# EAGLE design rng1 (EAGLE 6.5.0)

## Sheet 1 of 2
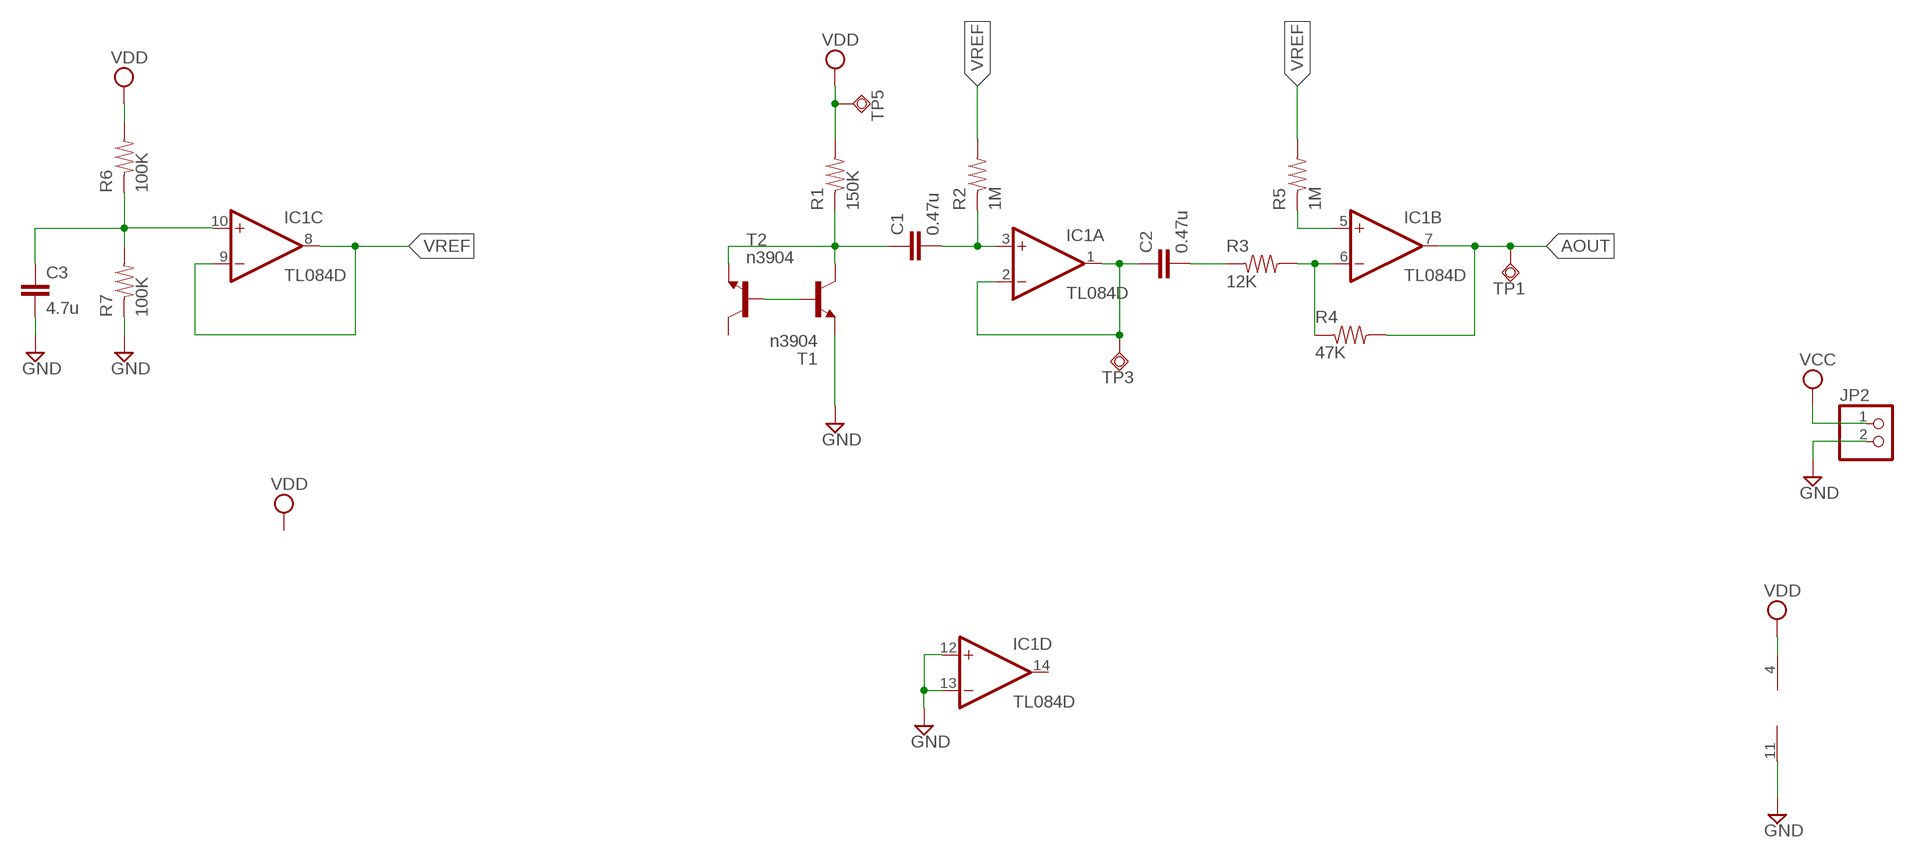
[diagram p0: schematic, sheet 1]

### Parts
C1  0.47u  C-EUC0805  [C0805]
C2  0.47u  C-EUC0805  [C0805]
C3  4.7u  C-EUC0805  [C0805]
IC1  TL084D  [SO14]
JP2  PINHD-1X2  [1X02]
R1  150K  R0805  [R0805]
R2  1M  R0805  [R0805]
R3  12K  R0805  [R0805]
R4  47K  R0805  [R0805]
R5  1M  R0805  [R0805]
R6  100K  R0805  [R0805]
R7  100K  R0805  [R0805]
T1  n3904  MMBT3904LT1-NPN-SOT23-BEC  [SOT23-BEC]
T2  n3904  MMBT3904LT1-NPN-SOT23-BEC  [SOT23-BEC]
TP1  TPSQPAD1-13  [P1-13]
TP3  TPSQPAD1-13  [P1-13]
TP5  TPSQPAD1-13  [P1-13]

### Nets
AOUT: IC1.7(B:OUT) R4.P$2 TP1.TP
GND: C3.2 IC1.11(P:V-) IC1.12(D:+IN) IC1.13(D:-IN) JP2.2 R7.P$1 T2.E ; also sheet 2
N$1: C1.1 R1.P$1 T1.E T2.C
N$2: C3.1 IC1.10(C:+IN) R6.P$1 R7.P$2
N$3: T1.B T2.B
N$4: C1.2 IC1.3(A:+IN) R2.P$1
N$5: C2.1 IC1.1(A:OUT) IC1.2(A:-IN) TP3.TP
N$6: C2.2 R3.P$1
N$7: IC1.6(B:-IN) R3.P$2 R4.P$1
N$8: IC1.5(B:+IN) R5.P$1
VCC: JP2.1 ; also sheet 2
VDD: IC1.4(P:V+) R1.P$2 R6.P$2 TP5.TP ; also sheet 2
VREF: IC1.8(C:OUT) IC1.9(C:-IN) R2.P$2 R5.P$2
Unconnected: IC1.14(D:OUT) T1.C

## Sheet 2 of 2
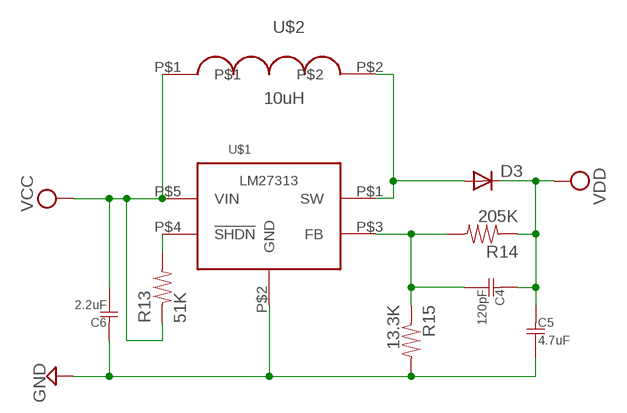
[diagram p1: schematic, sheet 2]

### Parts
C4  120pF  C0805  [R0805]
C5  4.7uF  C0805  [R0805]
C6  2.2uF  C0805  [R0805]
D3  DIODE-SOD123  [SOD123]
R13  51K  R0805  [R0805]
R14  205K  R0805  [R0805]
R15  13.3K  R0805  [R0805]
U$1  LM27313  [SOT-23-5]
U$2  10uH  CB2518  [L1007]

### Nets
GND: C5.P$2 C6.P$1 R15.P$2 U$1.P$2(GND) ; also sheet 1
N$13: R13.P$2 U$1.P$4(!SHDN!)
N$17: D3.A U$1.P$1(SW) U$2.P$2
N$18: C4.P$2 R14.P$2 R15.P$1 U$1.P$3(FB)
VCC: C6.P$2 R13.P$1 U$1.P$5(VIN) U$2.P$1 ; also sheet 1
VDD: C4.P$1 C5.P$1 D3.C R14.P$1 ; also sheet 1

## Library data of the parts
C1-C3 = rcl:C-EU: CAPACITOR, European symbol
C4-C6 = Passives:C
D3 = diode:DIODE-: DIODE
IC1 = linear:TL084: OP AMP
JP2 = pinhead:PINHD-1X2: PIN HEADER
R1-R7 R13-R15 = Passives:R: A standard resistor.
T1 T2 = transistor:*-NPN-: NPN Transistror BF959 corrected 2008.03.06
TP1 TP3 TP5 = testpad:TPSQ: Test pad
U$1 = rng:LM27313
U$2 = rng:CB2518: Inductor

## Board
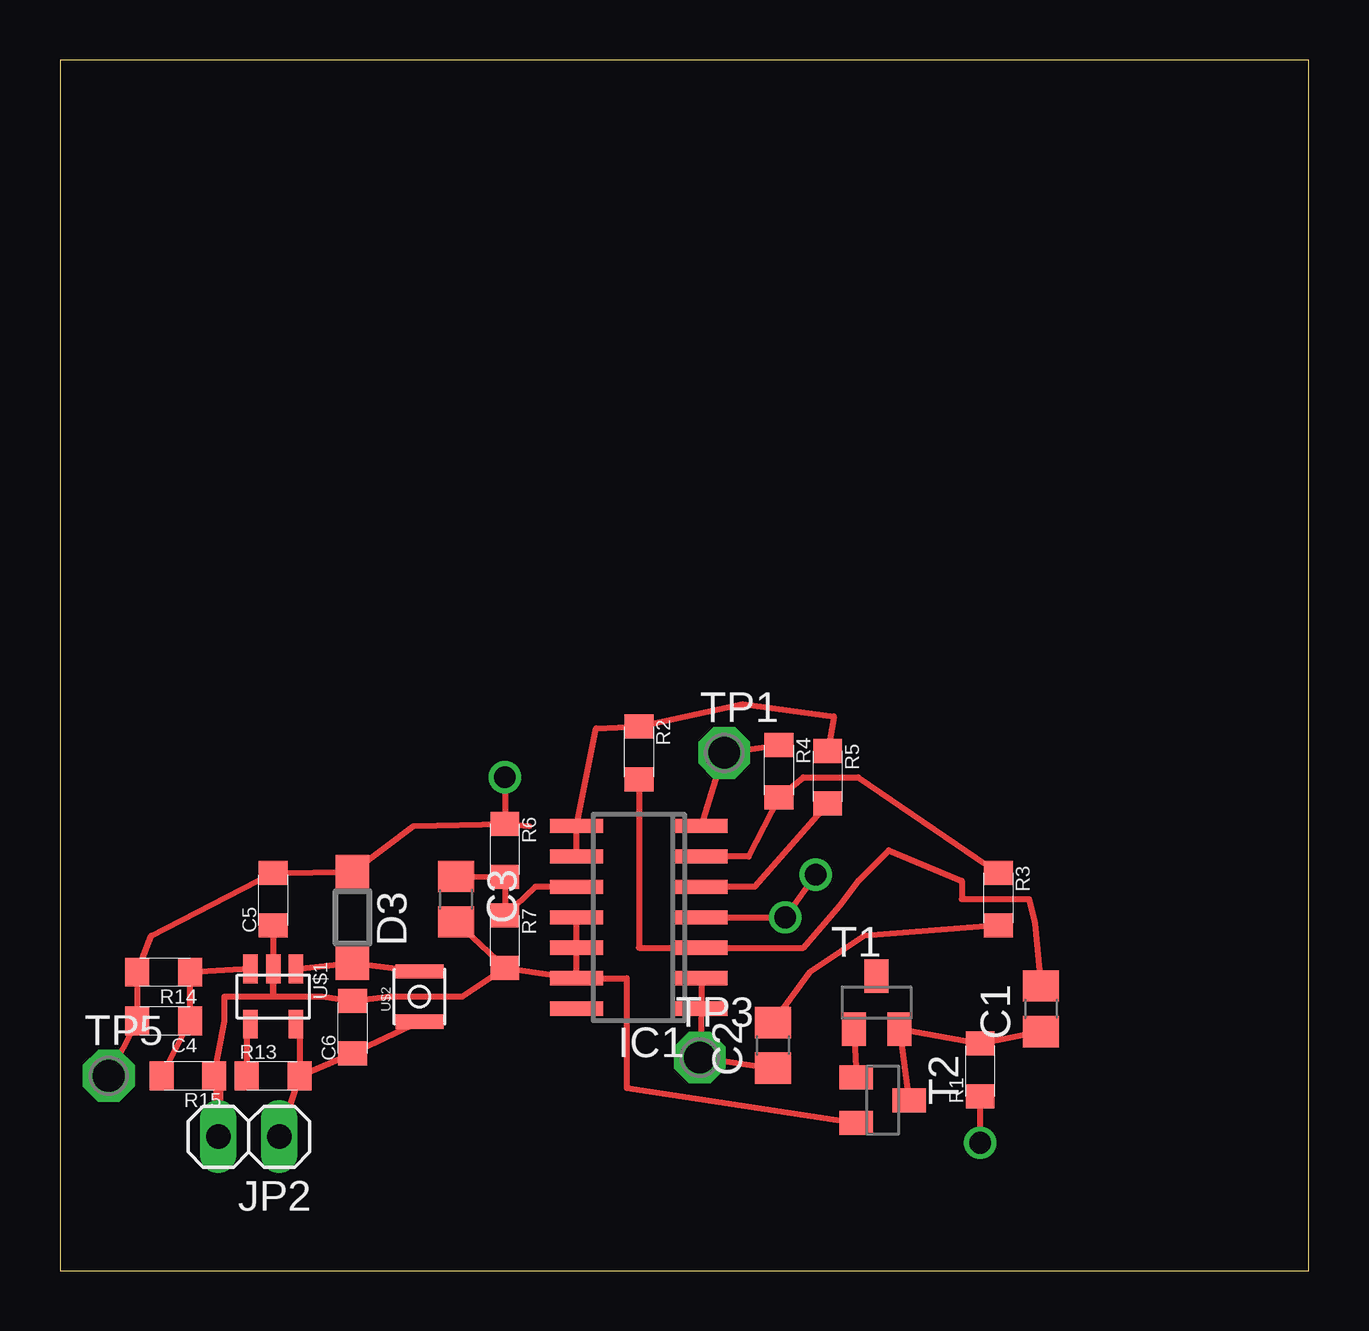
[diagram p2: board, top side]
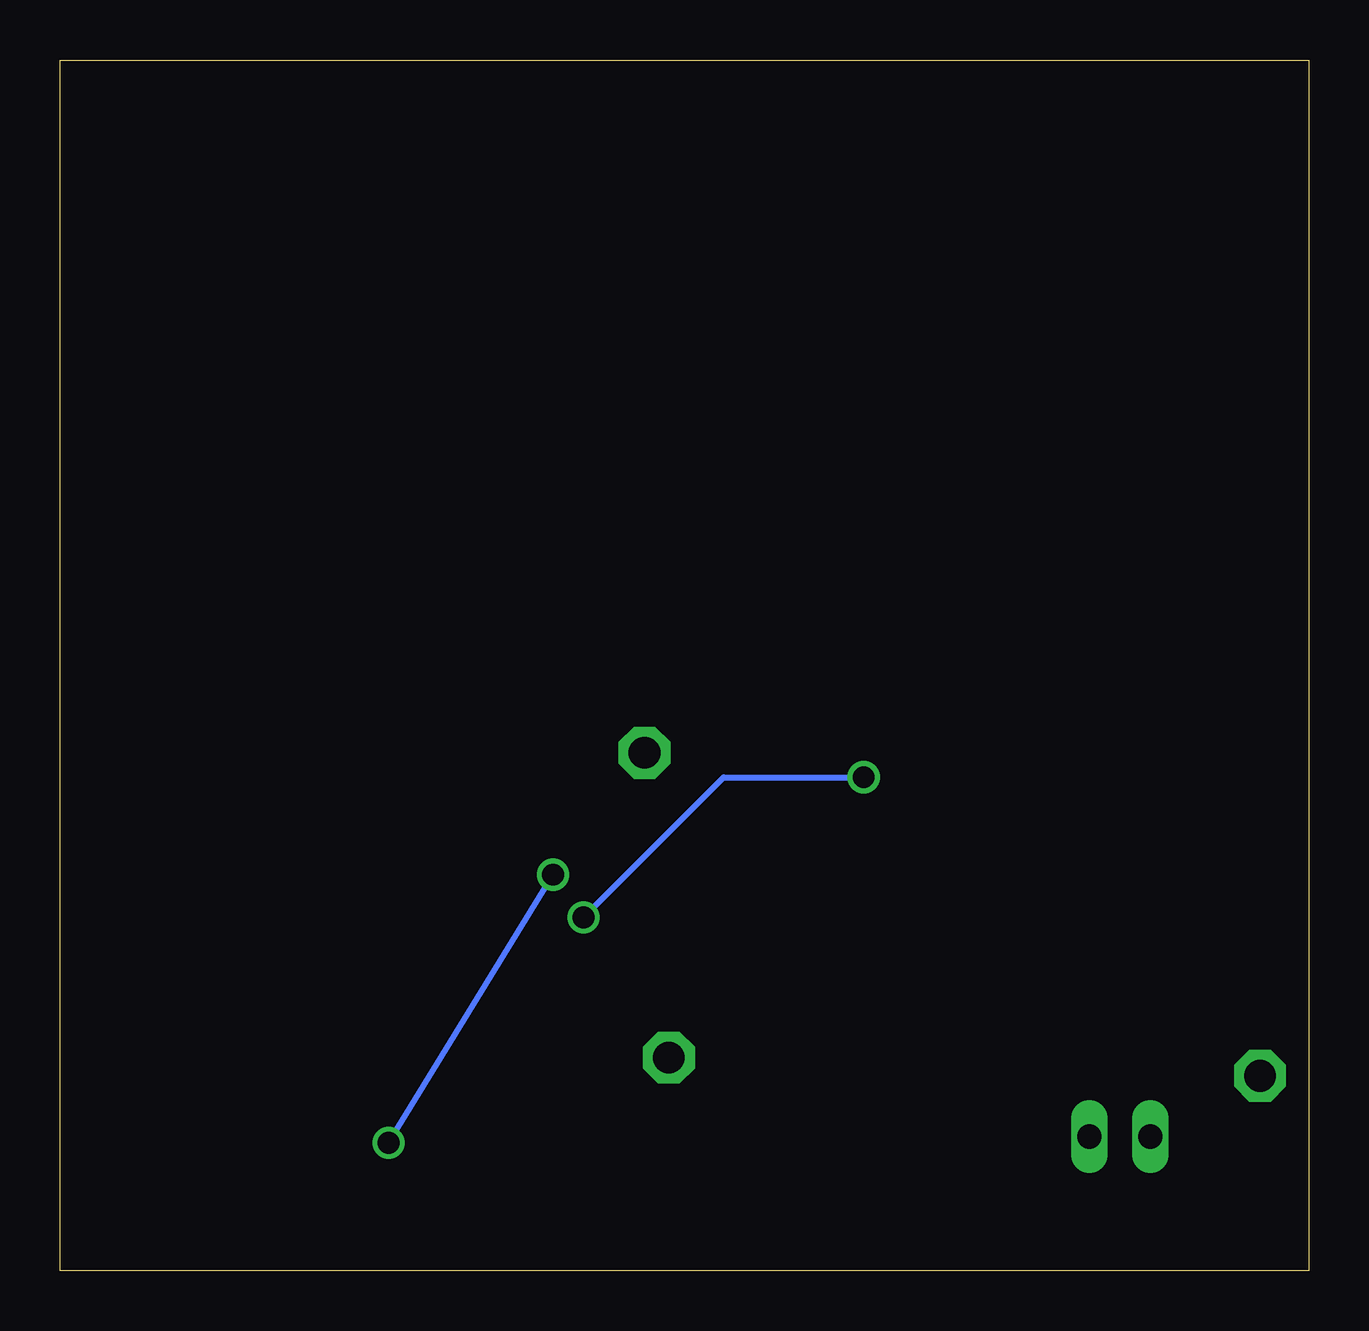
[diagram p3: board, bottom side, seen from below]

Size 52.05 x 50.47 mm. Coordinates in mm from the lower left corner, seen from the top.
Outline: 0,0 52.05,0 52.05,50.47 0,50.47 0,0
Copper layers (1*16): Top 0.035mm / dielectric 1.5mm / Bottom 0.035mm
Design rules "default *": minimum track width 12mil, minimum drill 24mil, track to track 20mil, track to pad 20mil, pad to pad 20mil, via to via 20mil, smd to smd 8mil, copper to edge 40mil, drill to drill 8mil, minimum pad ring 10mil, minimum via ring 8mil, stop-mask expansion 4mil, vias tented up to drill 0mil, thermal gap 10mil

### Footprints (pad centres in the part's own frame; a part is rotated, then mirrored left to right if it is on the bottom)
C0805 = smd 1.3 x 1.5: 1 -0.95,0; 2 0.95,0
R0805 = smd 1 x 1.2: P$1 1.1,0; P$2 -1.1,0
SOD123 = smd 1.4 x 1.4: A 1.9,0; C -1.9,0
SO14 = smd 0.6 x 2.2: 1 -3.81,-2.6; 2 -2.54,-2.6; 3 -1.27,-2.6; 4 0,-2.6; 5 1.27,-2.6; 6 2.54,-2.6; 7 3.81,-2.6; 8 3.81,2.6; 9 2.54,2.6; 10 1.27,2.6; 11 0,2.6; 12 -1.27,2.6; 13 -2.54,2.6; 14 -3.81,2.6
1X02 = drill 1.016 long: 1 -1.27,0; 2 1.27,0
SOT23-BEC = smd 1 x 1.4: B -0.95,-1.1; C 0,1.1; E 0.95,-1.1
P1-13 = drill 1.321 pad 2.159 octagon: TP 0,0
SOT-23-5 = smd 0.6 x 1.2: P$1 -0.95,-1.15; P$2 0,-1.15; P$3 0.95,-1.15; P$4 0.95,1.15; P$5 -0.95,1.15
L1007 = smd 0.6 x 2: P$1 -1.05,0; P$2 1.05,0

### Placement (x,y rotation side)
C1  40.89,10.92 90 top
C2  29.72,9.4 90 top
C3  16.51,15.49 270 top
C4  4.32,10.41 180 top
C5  8.89,15.49 90 top
C6  12.19,10.16 90 top
D3  12.19,14.73 270 top
IC1  24.13,14.73 90 top
JP2  7.87,5.59 180 top
R1  38.35,8.38 90 top
R2  24.13,21.59 270 top
R3  39.12,15.49 270 top
R4  29.97,20.83 270 top
R5  32,20.57 270 top
R6  18.54,17.53 270 top
R7  18.54,13.72 270 top
R13  8.89,8.13 0 top
R14  4.32,12.45 180 top
R15  5.33,8.13 180 top
T1  34.04,11.18 0 top
T2  34.29,7.11 270 top
TP1  27.69,21.59 0 top
TP3  26.67,8.89 0 top
TP5  2.03,8.13 0 top
U$1  8.89,11.43 180 top
U$2  14.99,11.43 90 top

### Tracks (layer width: path | path; a pad name or v marks a point on that pad's centre or on a via)
AOUT
  Top 0.254: R4.P$2 TP1.TP IC1.7
GND
  Top 0.254: C5.P$2 U$1.P$2 | R15.P$2 6.86,10.41 6.86,11.43 8.89,11.43 | 8.89,11.43 U$1.P$2 | U$1.P$2 8.89,11.43 | 8.89,11.43 10.92,11.43 C6.P$1 13.72,11.43 16.76,11.43 R7.P$1 | C3.2 R7.P$1 | R7.P$1 IC1.13 | IC1.13 IC1.12 IC1.11 | IC1.13 23.62,12.19 23.62,7.62 T2.E
  Top 0.406: R15.P$2 6.6,8.13 JP2.2
N$1
  Top 0.254: C1.1 R1.P$1 T1.E T2.C
N$2
  Top 0.254: C3.1 R6.P$1 R7.P$2 19.81,16 IC1.10
N$3
  Top 0.254: T1.B T2.B
N$4
  Top 0.254: R2.P$1 24.13,13.46 IC1.3 30.99,13.46 32.51,15.24 33.27,16.26 34.54,17.53 37.59,16.26 37.59,15.49 40.39,15.49 40.64,14.48 C1.2
N$5
  Top 0.254: IC1.2 IC1.1 TP3.TP C2.1
N$6
  Top 0.254: R3.P$1 33.53,13.97 31.24,12.45 C2.2
N$7
  Top 0.254: IC1.6 28.7,17.27 R4.P$1 30.99,20.57 33.27,20.57 R3.P$2
N$8
  Top 0.254: R5.P$1 28.96,16 IC1.5
N$13
  Top 0.254: U$1.P$4 7.79,10.28 R13.P$2
N$17
  Top 0.254: U$1.P$1 D3.A U$2.P$2
N$18
  Top 0.254: R15.P$1 C4.P$2 R14.P$2 U$1.P$3
VCC
  Top 0.254: U$1.P$5 9.99,10.28 R13.P$1 | R13.P$1 JP2.1 | R13.P$1 C6.P$2 U$2.P$1
VDD  (via drill 0.9 pad 0.61)
  Top 0.254: TP5.TP C4.P$1 R14.P$1 3.81,13.97 C5.P$1 D3.C 14.73,18.54 R6.P$2 | R6.P$2 19.56,18.54 | v18.54,20.57 R6.P$2 | IC1.4 v30.23,14.73 v31.5,16.51 | R1.P$2 v38.35,5.33
  Bottom 0.254: v30.23,14.73 24.38,20.57 v18.54,20.57 | v38.35,5.33 v31.5,16.51
VREF
  Top 0.254: IC1.9 IC1.8 22.35,22.61 R2.P$2 28.45,23.62 32.26,23.11 R5.P$2